# EasyEDA schematic schematic.json
TITLE: Sheet_1; REV: 1.0; Date: 2025-03-06; Sheet: 1/1; Drawn By: b3arora; Company: Your Company
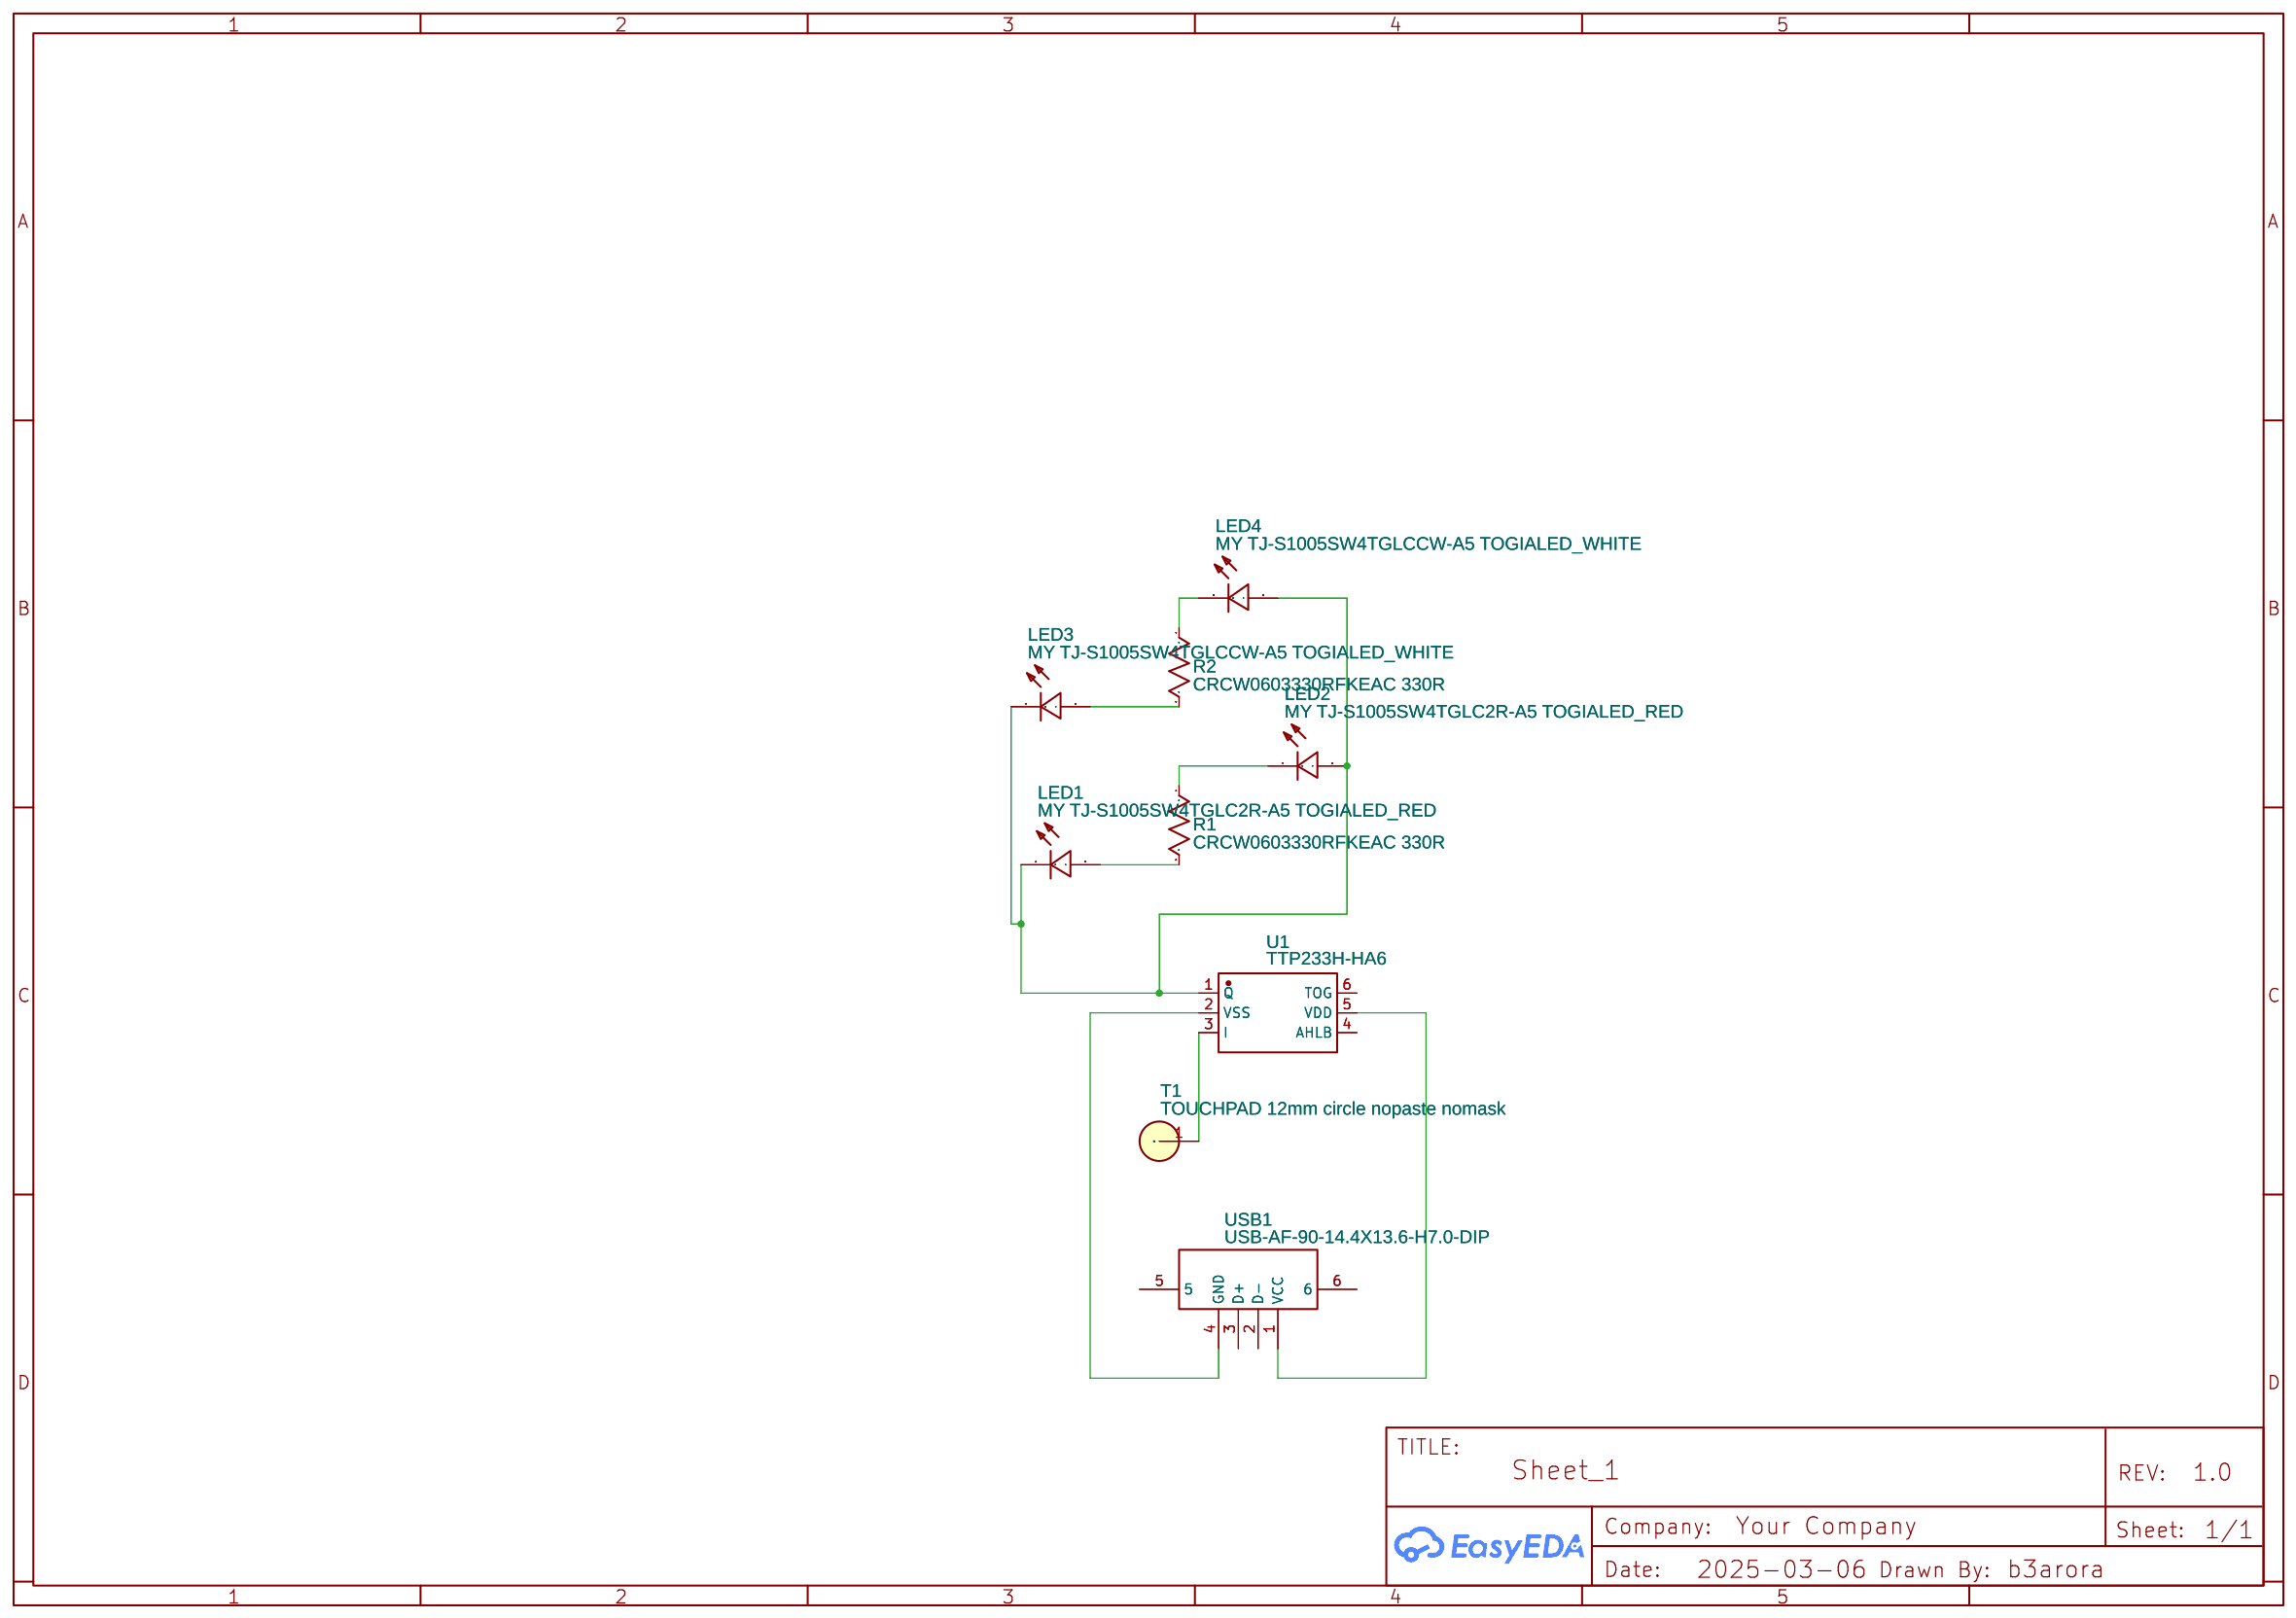
[diagram p0: schematic sheet]

## Parts
LED1  MY TJ-S1005SW4TGLC2R-A5 TOGIALED_RED  [MY LED0402-RD NO_SILKSCREEN]
LED2  MY TJ-S1005SW4TGLC2R-A5 TOGIALED_RED  [MY LED0402-RD NO_SILKSCREEN]
LED3  MY TJ-S1005SW4TGLCCW-A5 TOGIALED_WHITE  [MY LED0402-RD_WHITE NO_SILKSCREEN]
LED4  MY TJ-S1005SW4TGLCCW-A5 TOGIALED_WHITE  [MY LED0402-RD_WHITE NO_SILKSCREEN]
R1  CRCW0603330RFKEAC 330R  [R0603]
R2  CRCW0603330RFKEAC 330R  [R0603]
T1  TOUCHPAD 12mm circle nopaste nomask  [TOUCHPAD 12MM CIRCLE NOPASTE NOMASK]
U1  TTP233H-HA6  [SOT-23-6_L2.9-W1.6-P0.95-LS2.8-BL]
USB1  USB-AF-90-14.4X13.6-H7.0-DIP  [USB-A-TH_C46407]

## Library data of the parts
LED1 LED2 = MY TJ-S1005SW4TGLC2R-A5 TOGIALED_RED: Contributor: LCSC; Supplier: LCSC; Supplier Part: C273598; Manufacturer: TOGIALED(统佳); Manufacturer Part: TJ-S1005SW4TGLC2R-A5; JLCPCB Part Class: Extended Part
LED3 LED4 = MY TJ-S1005SW4TGLCCW-A5 TOGIALED_WHITE: Contributor: LCSC; Supplier: LCSC; Supplier Part: C273604; Manufacturer: TOGIALED(统佳); Manufacturer Part: TJ-S1005SW4TGLCCW-A5; JLCPCB Part Class: Extended Part
R1 R2 = CRCW0603330RFKEAC 330R: Supplier: Mouser; Supplier Part: 71-CRCW0603330RFKEAC; Manufacturer: Vishay; Manufacturer Part: CRCW0603330RFKEAC; Contributor: LCSC; Resistance: 330R; Link: https://mou.sr/3Bq59d0; Preço: $0.008
T1 = TOUCHPAD 12mm circle nopaste nomask: Contributor: extras2765
U1 = TTP233H-HA6: Contributor: LCSC; Supplier: LCSC; Supplier Part: C2835626; Manufacturer: TONTEK(通泰); JLCPCB Part Class: Extended Part
USB1 = USB-AF-90-14.4X13.6-H7.0-DIP: Contributor: LCSC; Supplier: LCSC; Supplier Part: C46407; Manufacturer: 精拓金; Manufacturer Part: 903-131A1011D10100; JLCPCB Part Class: Extended Part

## Nets
Net-(LED1-1): LED1.1(C) LED2.2(A) LED3.1(C) LED4.2(A) U1.1(Q)
Net-(LED1-2): LED1.2(A) R1.2
Net-(LED2-1): LED2.1(C) R1.1
Net-(LED3-2): LED3.2(A) R2.2
Net-(LED4-1): LED4.1(C) R2.1
Net-(T1-1): T1.1(Touch) U1.3(I)
Net-(U1-2): U1.2(VSS) USB1.4(GND)
Net-(U1-5): U1.5(VDD) USB1.1(VCC)

Not connected (* = marked no-connect by the designer): U1 4(AHLB) 6(TOG); USB1 2(D-) 3(D+) 5 6
